# Altium schematic sheet External_Connections.SchDoc
size A4; SheetNumber: 10
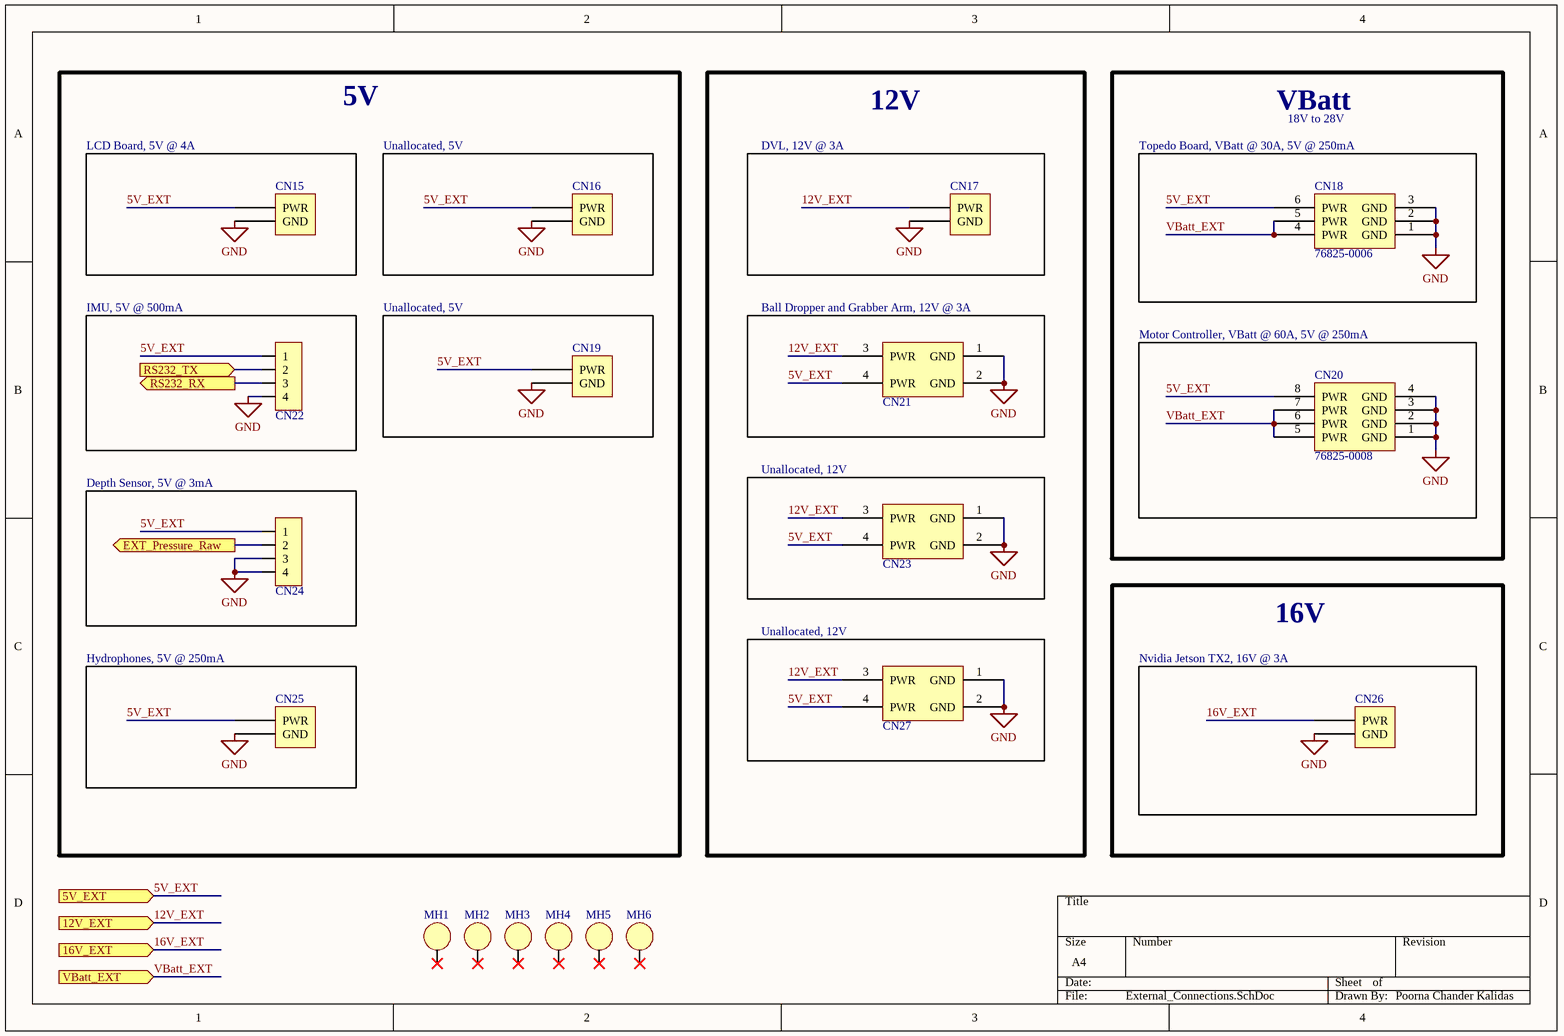
[diagram p0: External_Connections.SchDoc]

## Parts
CN15  Header, Female, 1x2, Right Angle, Pitch 0.118" (3.00mm), THT  [New footprint 1]  (value not drawn)
CN16  Header, Female, 1x2, Right Angle, Pitch 0.118" (3.00mm), THT  [New footprint 1]  (value not drawn)
CN17  Header, Female, 1x2, Right Angle, Pitch 0.118" (3.00mm), THT  [New footprint 1]  (value not drawn)
CN18  76825-0006  [76825-0006-Footprint-1]
CN19  Header, Female, 1x2, Right Angle, Pitch 0.118" (3.00mm), THT  [New footprint 1]  (value not drawn)
CN20  76825-0008  [76825-0008-Footprint-1]
CN21  Header, Female, 2x2, RIght Angle, Pitch: 0.118"  (3.00mm), THT  [2x2 Pitch 118mil connector]  (value not drawn)
CN22  Header, Male, 1x4, RA, Pitch 0.1" (2.54mm)  [HEADER, MALE, SHROUDED, 4x1, PITCH 0.1" (2.54mm), RA]  (value not drawn)
CN23  Header, Female, 2x2, RIght Angle, Pitch: 0.118"  (3.00mm), THT  [2x2 Pitch 118mil connector]  (value not drawn)
CN24  Header, Male, 1x4, RA, Pitch 0.1" (2.54mm)  [HEADER, MALE, SHROUDED, 4x1, PITCH 0.1" (2.54mm), RA]  (value not drawn)
CN25  Header, Female, 1x2, Right Angle, Pitch 0.118" (3.00mm), THT  [New footprint 1]  (value not drawn)
CN26  Header, Female, 1x2, Right Angle, Pitch 0.118" (3.00mm), THT  [New footprint 1]  (value not drawn)
CN27  Header, Female, 2x2, RIght Angle, Pitch: 0.118"  (3.00mm), THT  [2x2 Pitch 118mil connector]  (value not drawn)
MH1  Mount_Hole_3mm  [Mount-Hole_3mm]  (value not drawn)
MH2  Mount_Hole_3mm  [Mount-Hole_3mm]  (value not drawn)
MH3  Mount_Hole_3mm  [Mount-Hole_3mm]  (value not drawn)
MH4  Mount_Hole_3mm  [Mount-Hole_3mm]  (value not drawn)
MH5  Mount_Hole_3mm  [Mount-Hole_3mm]  (value not drawn)
MH6  Mount_Hole_3mm  [Mount-Hole_3mm]  (value not drawn)

## Blocks framed on the sheet
LCD Board, 5V @ 4A: CN15
Unallocated, 5V: CN16
DVL, 12V @ 3A: CN17
Topedo Board, VBatt @ 30A, 5V @ 250mA: CN18
IMU, 5V @ 500mA: CN22
Unallocated, 5V: CN19
Ball Dropper and Grabber Arm, 12V @ 3A: CN21
Motor Controller, VBatt @ 60A, 5V @ 250mA: CN20
Depth Sensor, 5V @ 3mA: CN24
Unallocated, 12V: CN23
Hydrophones, 5V @ 250mA: CN25
Unallocated, 12V: CN27
Nvidia Jetson TX2, 16V @ 3A: CN26

## Ports
5V_EXT (in), 12V_EXT (in), 16V_EXT (in), EXT_Pressure_Raw (out), RS232_RX (out), RS232_TX (in), VBatt_EXT (in)

## Nets
GND: CN15.1(GND) CN16.1(GND) CN17.1(GND) CN18.1(GND) CN18.2(GND) CN18.3(GND) CN19.1(GND) CN20.1(GND) CN20.2(GND) CN20.3(GND) CN20.4(GND) CN21.1(GND) CN21.2(GND) CN22.4 CN23.1(GND) CN23.2(GND) CN24.3 CN24.4 CN25.1(GND) CN26.1(GND) CN27.1(GND) CN27.2(GND)
5V_EXT: CN15.2(PWR) CN16.2(PWR) CN18.6(PWR) CN19.2(PWR) CN20.8(PWR) CN21.4(PWR) CN22.1 CN23.4(PWR) CN24.1 CN25.2(PWR) CN27.4(PWR) ; port 5V_EXT
12V_EXT: CN17.2(PWR) CN21.3(PWR) CN23.3(PWR) CN27.3(PWR) ; port 12V_EXT
16V_EXT: CN26.2(PWR) ; port 16V_EXT
EXT_Pressure_Raw: CN24.2 ; port EXT_Pressure_Raw
RS232_RX: CN22.3 ; port RS232_RX
RS232_TX: CN22.2 ; port RS232_TX
VBatt_EXT: CN18.4(PWR) CN18.5(PWR) CN20.5(PWR) CN20.6(PWR) CN20.7(PWR) ; port VBatt_EXT

Not connected (* = marked no-connect by the designer): MH1 1*; MH2 1*; MH3 1*; MH4 1*; MH5 1*; MH6 1*

## Notes on the sheet
- 5V
- 12V
- VBatt
- 18V to 28V
- 16V
- Poorna Chander Kalidas

## Library data of the parts
CN15-CN17 CN19 CN25 CN26 = CMP-00001-4: Connector Header Through Hole, Right Angle 2 position; Gender: Male; Max Voltage Rating (DC): 250.25kV; Number of Contacts: 2; Current Rating: 5A; Glow Wire Compliant: Compliant; Voltage Rating: 600V; Voltage Rating (DC): 250V; Insulation Resistance: 1GR; Pitch: 3mm; Contact Resistance: 10mR; Length: 7.15mm; Contact Material: Brass; Housing Color: Black; Contact Plating: Gold; Packaging: Tray; Mount: Through Hole; Diameter: 3mm; Housing Material: Thermoplastic; Case/Package: SMC; Depth: 12.2mm; Termination: Solder; Color: Black; Max Current Rating: 5A; Number of Positions: 2; Lead Free: Contains Lead; Min Operating Temperature: -40°C; Number of Rows: 2; Height: 8.77mm; Package Quantity: 3168; Number of Circuits: 2; Max Operating Temperature: 105°C; Radiation Hardening: No; Flammability Rating: UL94 V-0; Orientation: Right Angle; Halogen Free: Low Halogen
CN18 = CMP-00049-2: CONNECTOR, HEADER, 6POS, 2ROW, 5.7MM; Product Range:Mega-Fit 76825 Series; Contact Termination Type:Through Hole; Gender:Header; No. of Contacts:6; Pitch Spacing:5.7mm; Contact Plating:Tin Plated Contacts; Contact Material:Copper; Number of Circuits: 6; Gender: Male; Mount: Through Hole; Color: Black; Number of Rows: 2; Contact Material: Copper; Termination: Through Hole; Orientation: Right Angle; Number of Pins: 6; Pitch: 5.7mm; REACH SVHC: Unknown; Contact Plating: Tin; Number of Contacts: 6
CN20 = CMP-00051-3: MOLEX         76825-0008.             CONNECTOR, HEADER, 8POS, 2ROW, 5.7MM; Number of Circuits: 8; Gender: Male; Color: Black; Contact Material: Copper; Pitch: 5.7mm; Number of Rows: 2; Mount: Through Hole; Number of Contacts: 8; Number of Pins: 8; Orientation: Right Angle; Contact Plating: Tin; REACH SVHC: Unknown; Termination: Through Hole
CN21 CN23 CN27 = CMP-005-0021-4: Connector Header Through Hole, Right Angle 4 position 0.118" (3.00mm); Design Item ID: Header, Female, 2x2, RIght Angle, Pitch: 0.118"  (3.00mm), THT; Publisher: AUVic; Component Type: Standard; Created By: Poorna Chander Kalidas; Source: AUVic_Schematic_Library_Connectors.SchLib; Date Published: 2020-05-16; Pin Count: 4
CN22 CN24 = CMP-005-0029-3: Connector Header Through Hole, Right Angle 4 position 0.100" (2.54mm); Source: AUVic_Schematic_Library_Connectors.SchLib; Created On: 2020-05-20; Pin Count: 4; Component Type: Standard; Design Item ID: Header, Male, 1x4, RA, Pitch 0.1" (2.54mm); Created By: Miguel Manguerra
MH1-MH6 = CMP-004-0010-4: Mounting hold for M3 hex standoff; Source: AUVic_Schematic_Library_Connectors.SchLib; Design Item ID: Mount_Hole_3mm; Component Type: Standard; Pin Count: 1